# Altium project MasterBoard.PrjPCB
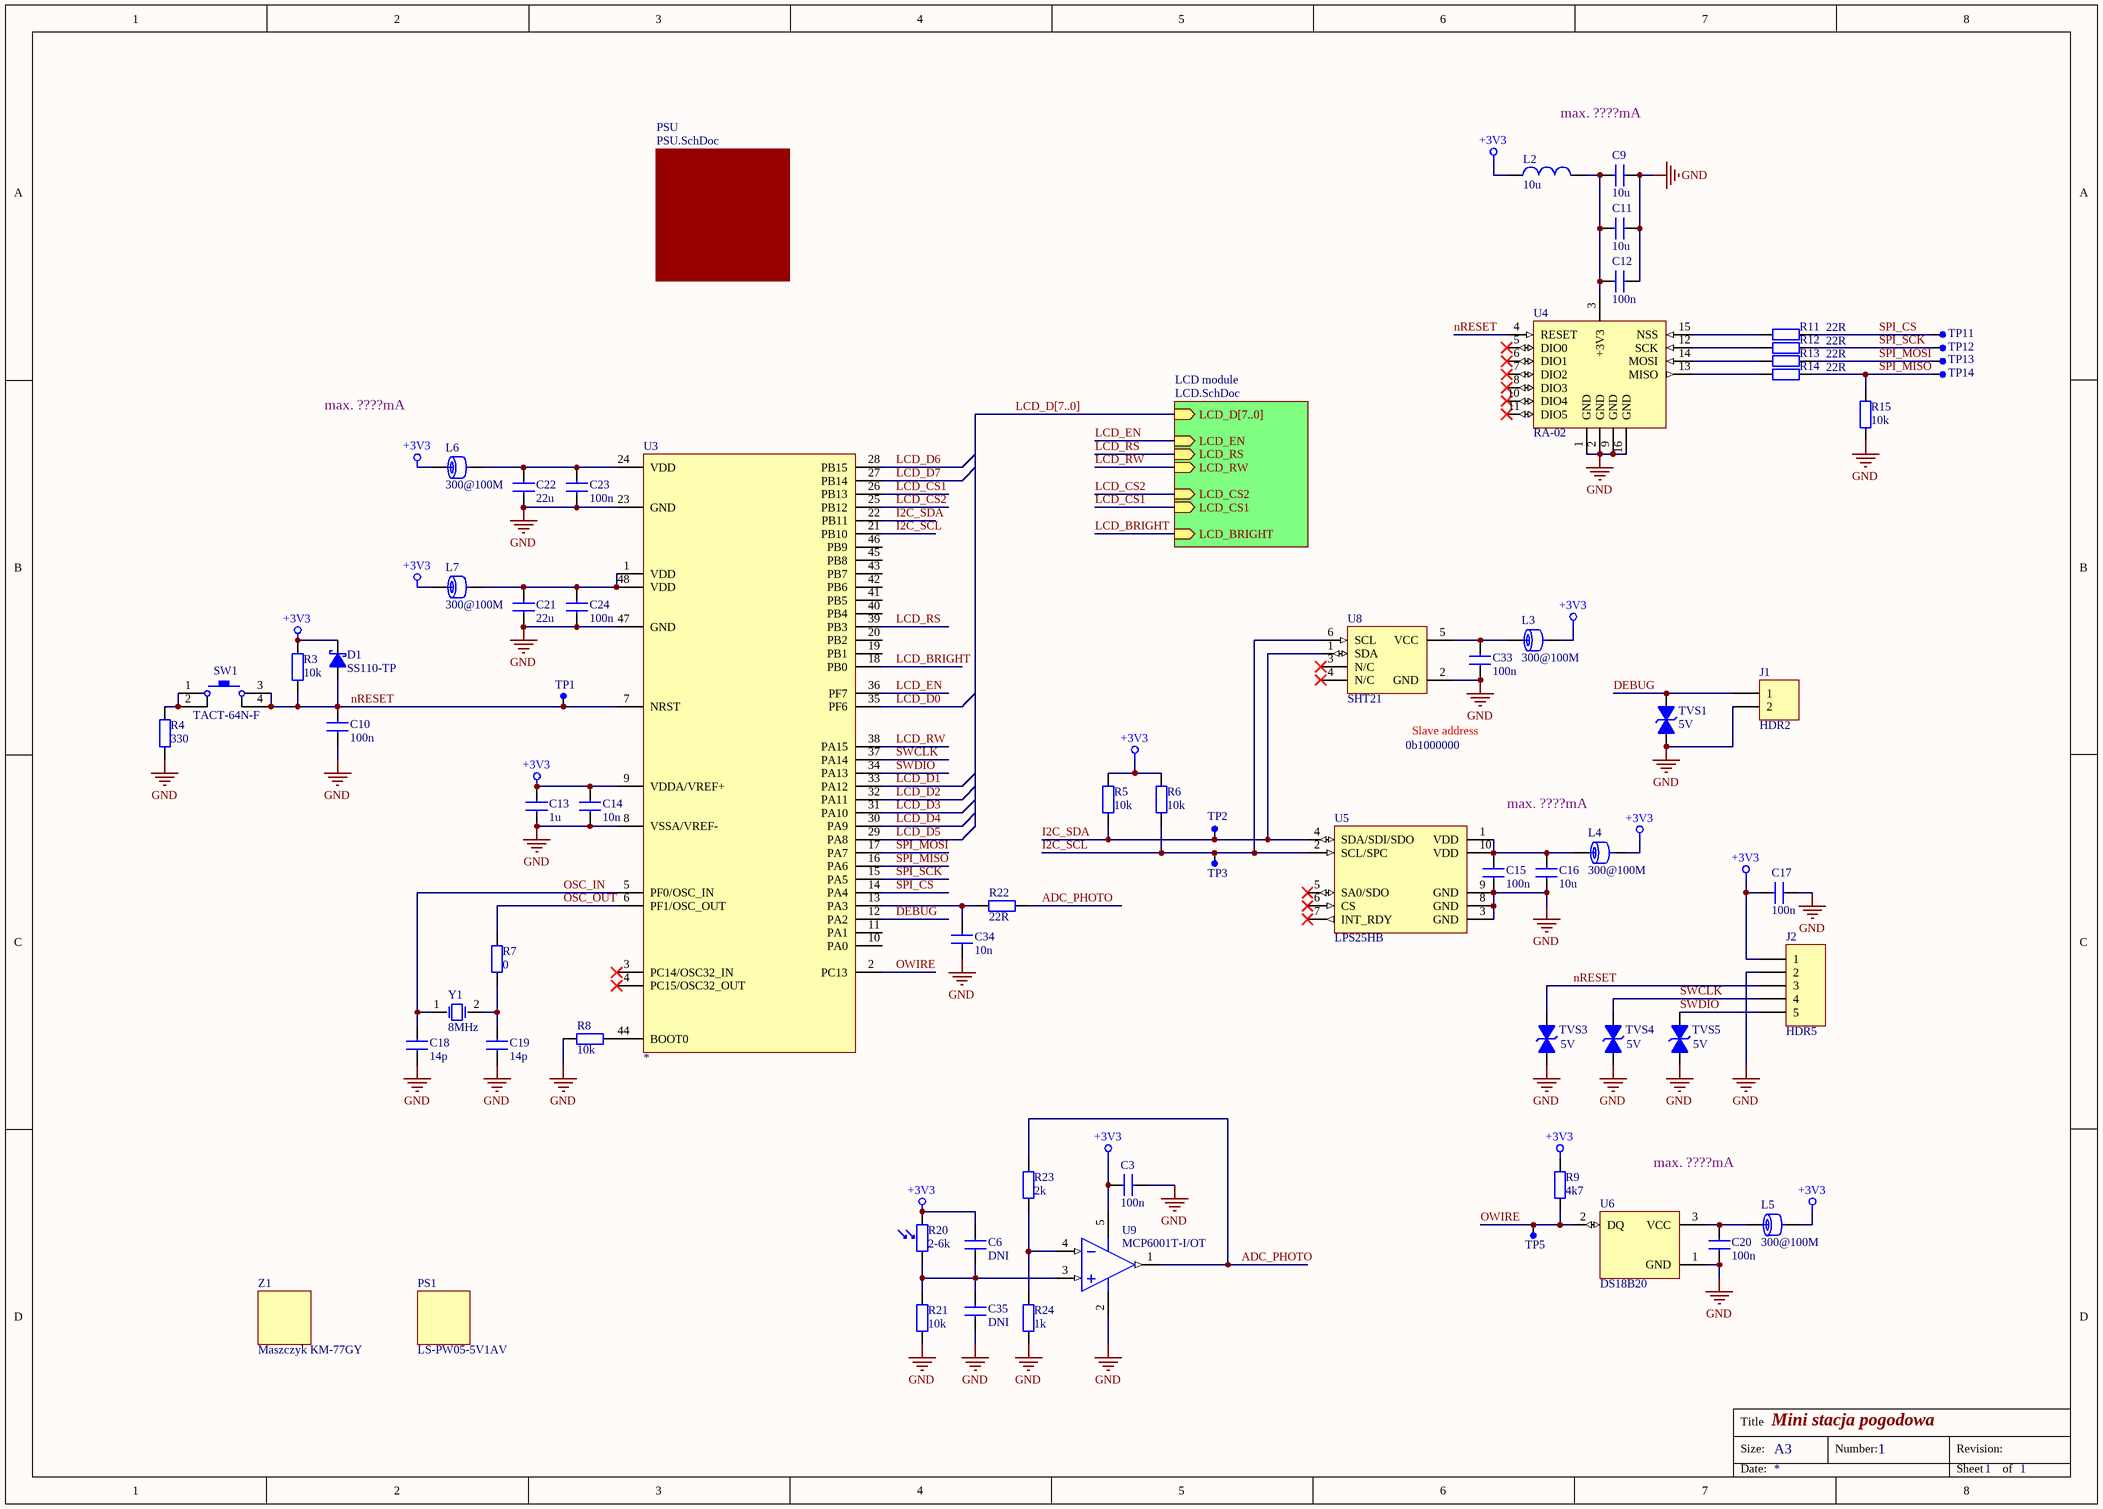
[diagram p0: Main.SchDoc]
.revision: 1.0
1 sheet, 69 parts. Net scope: hierarchical (ports join the sheet entries above them; power ports are global).
Board file: PCB.PcbDoc

## Sheet Main.SchDoc: Mini stacja pogodowa
size A3; DrawnBy: Damian Dolewski; Engineer: Damian Dolewski; DocumentNumber: 1; Revision: 1.0; SheetNumber: 1; SheetTotal: 1

### Parts
C3  value 100n  [C_0805]  (hidden comment: Capacitor)
C6  value DNI  [C_0805]  (hidden comment: Capacitor)
C9  value 10u  [C_0805]  (hidden comment: Capacitor)
C10  value 100n  [C_0805]  (hidden comment: Capacitor)
C11  value 10u  [C_0805]  (hidden comment: Capacitor)
C12  value 100n  [C_0805]  (hidden comment: Capacitor)
C13  value 1u  [C_0805]  (hidden comment: Capacitor)
C14  value 10n  [C_0805]  (hidden comment: Capacitor)
C15  value 100n  [C_0805]  (hidden comment: Capacitor)
C16  value 10u  [C_0805]  (hidden comment: Capacitor)
C17  value 100n  [C_0805]  (hidden comment: Capacitor)
C18  value 14p  [C_0805]  (hidden comment: Capacitor)
C19  value 14p  [C_0805]  (hidden comment: Capacitor)
C20  value 100n  [C_0805]  (hidden comment: Capacitor)
C21  value 22u  [C_0805]  (hidden comment: Capacitor)
C22  value 22u  [C_0805]  (hidden comment: Capacitor)
C23  value 100n  [C_0805]  (hidden comment: Capacitor)
C24  value 100n  [C_0805]  (hidden comment: Capacitor)
C33  value 100n  [C_0805]  (hidden comment: Capacitor)
C34  value 10n  [C_0805]  (hidden comment: Capacitor)
C35  value DNI  [C_0805]  (hidden comment: Capacitor)
D1  SS110-TP  [D_1206]
J1  value HDR2  [header 2.54mm 2pin]  (hidden comment: Header 2)
J2  value HDR5  [header 2.54mm 5pin]  (hidden comment: Header 5)
L2  value 10u  [L_0805]  (hidden comment: Inductor)
L3  value 300@100M  [L_0805]  (hidden comment: 742792031)
L4  value 300@100M  [L_0805]  (hidden comment: 742792031)
L5  value 300@100M  [L_0805]  (hidden comment: 742792031)
L6  value 300@100M  [L_0805]  (hidden comment: 742792031)
L7  value 300@100M  [L_0805]  (hidden comment: 742792031)
PS1  LS-PW05-5V1AV  (mechanical)
R3  value 10k  [R_0805]  (hidden comment: Resistor)
R4  value 330  [R_0805]  (hidden comment: Resistor)
R5  value 10k  [R_1206]  (hidden comment: Resistor)
R6  value 10k  [R_1206]  (hidden comment: Resistor)
R7  value 0  [R_0805]  (hidden comment: Resistor)
R8  value 10k  [R_1206]  (hidden comment: Resistor)
R9  value 4k7  [R_1206]  (hidden comment: Resistor)
R11  value 22R  [R_0805]  (hidden comment: Resistor)
R12  value 22R  [R_0805]  (hidden comment: Resistor)
R13  value 22R  [R_0805]  (hidden comment: Resistor)
R14  value 22R  [R_0805]  (hidden comment: Resistor)
R15  value 10k  [R_1206]  (hidden comment: Resistor)
R20  value 2-6k  [Photoresistor]  (hidden comment: PGM5506-MP)
R21  value 10k  [R_1206]  (hidden comment: Resistor)
R22  value 22R  [R_0805]  (hidden comment: Resistor)
R23  value 2k  [R_1206]  (hidden comment: Resistor)
R24  value 1k  [R_1206]  (hidden comment: Resistor)
SW1  value TACT-64N-F  [SPST_NO_1301]  (hidden comment: Switch-PB 4 Pins)
TP1  TEST PAD  [PIN]  (value not drawn)
TP2  TEST PAD  [PIN]  (value not drawn)
TP3  TEST PAD  [PIN]  (value not drawn)
TP5  TEST PAD  [PIN]  (value not drawn)
TP11  TEST PAD  [PIN]  (value not drawn)
TP12  TEST PAD  [PIN]  (value not drawn)
TP13  TEST PAD  [PIN]  (value not drawn)
TP14  TEST PAD  [PIN]  (value not drawn)
TVS1  value 5V  [D_1206]  (hidden comment: SMAJ5.0ALFCT-ND)
TVS3  value 5V  [D_SMA]  (hidden comment: SMAJ5.0ALFCT-ND)
TVS4  value 5V  [D_SMA]  (hidden comment: SMAJ5.0ALFCT-ND)
TVS5  value 5V  [D_SMA]  (hidden comment: SMAJ5.0ALFCT-ND)
U3  STM32F030C6T6  [LQFP-48]  (value not drawn)
U4  value RA-02  [RA-02]  (hidden comment: LoRa RA-02 SX1278 433MHz)
U5  LPS25HB  [LPS25HB]
U6  DS18B20  [TO-92]
U8  SHT21  [DFN6]
U9  value MCP6001T-I/OT  [SOT23-5]  (hidden comment: MCP6001T)
Y1  value 8MHz  [CFPX_217]  (hidden comment: 7A-8.000MAAE-T)
Z1  Maszczyk KM-77GY  [KM-77GY]

### Sub-sheets
LCD module = LCD.SchDoc (file not in this document): LCD_D[7..0] (in), LCD_CS1 (in), LCD_EN (in), LCD_RS (in), LCD_RW (in), LCD_CS2 (in), LCD_BRIGHT (in)
PSU = PSU.SchDoc (file not in this document): no entries

### Nets
+3V3: C3.2 C6.1 C13.2 C14.2 C17.2 D1.2(K) J2.1 L2.1 L3.2 L4.2 L5.2 L6.1 L7.1 R3.2 R5.2 R6.2 R9.2 R20.1 U3.9(VDDA/VREF+) U9.5(VCC+)
GND: C3.1 C9.1 C10.1 C11.1 C12.1 C13.1 C14.1 C15.1 C16.1 C17.1 C18.1 C19.1 C20.1 C21.2 C22.2 C23.2 C24.2 C33.1 C34.1 C35.2 J1.2 J2.2 R4.1 R8.2 R15.1 R21.1 R24.1 TVS1.1(A) TVS3.1(A) TVS4.1(A) TVS5.1(A) U3.8(VSSA/VREF-) U3.23(GND) U3.47(GND) U4.1(GND) U4.2(GND) U4.9(GND) U4.16(GND) U5.3(GND) U5.8(GND) U5.9(GND) U6.1(GND) U8.2(GND) U9.2(VCC-)
ADC_PHOTO: R22.1 R23.2 U9.1(OUT)
DEBUG: J1.1 TVS1.2(K) U3.12(PA2)
I2C_SCL: R6.1 TP3.1 U3.21(PB10) U5.2(SCL/SPC) U8.6(SCL)
I2C_SDA: R5.1 TP2.1 U3.22(PB11) U5.4(SDA/SDI/SDO) U8.1(SDA)
LCD_BRIGHT: U3.18(PB0) ; sheet LCD module/LCD_BRIGHT
LCD_CS1: U3.26(PB13) ; sheet LCD module/LCD_CS1
LCD_CS2: U3.25(PB12) ; sheet LCD module/LCD_CS2
LCD_D0: U3.35(PF6)
LCD_D1: U3.33(PA12)
LCD_D2: U3.32(PA11)
LCD_D3: U3.31(PA10)
LCD_D4: U3.30(PA9)
LCD_D5: U3.29(PA8)
LCD_D6: U3.28(PB15)
LCD_D7: U3.27(PB14)
LCD_EN: U3.36(PF7) ; sheet LCD module/LCD_EN
LCD_RS: U3.39(PB3) ; sheet LCD module/LCD_RS
LCD_RW: U3.38(PA15) ; sheet LCD module/LCD_RW
nRESET: C10.2 D1.1(A) J2.3 R3.1 SW1.3 SW1.4 TP1.1 TVS3.2(K) U3.7(NRST) U4.4(RESET)
OSC_IN: C18.2 U3.5(PF0/OSC_IN) Y1.1(OSC1)
OSC_OUT: R7.2 U3.6(PF1/OSC_OUT)
OWIRE: R9.1 TP5.1 U3.2(PC13) U6.2(DQ)
SPI_CS: R11.1 TP11.1 U3.14(PA4)
SPI_MISO: R14.1 R15.2 TP14.1 U3.16(PA6)
SPI_MOSI: R13.1 TP13.1 U3.17(PA7)
SPI_SCK: R12.1 TP12.1 U3.15(PA5)
SWCLK: J2.4 TVS4.2(K) U3.37(PA14)
SWDIO: J2.5 TVS5.2(K) U3.34(PA13)
NetC6_2: C6.2 C35.1 R20.2 R21.2 U9.3(IN+)
NetC9_2: C9.2 C11.2 C12.2 L2.2 U4.3(+3V3)
NetC15_2: C15.2 C16.2 L4.1 U5.1(VDD) U5.10(VDD)
NetC19_2: C19.2 R7.1 Y1.2(OSC2)
NetC20_2: C20.2 L5.1 U6.3(VCC)
NetC21_1: C21.1 C24.1 L7.2 U3.1(VDD) U3.48(VDD)
NetC22_1: C22.1 C23.1 L6.2 U3.24(VDD)
NetC33_2: C33.2 L3.1 U8.5(VCC)
NetC34_2: C34.2 R22.2 U3.13(PA3)
NetR4_2: R4.2 SW1.1 SW1.2
NetR8_1: R8.1 U3.44(BOOT0)
NetR11_2: R11.2 U4.15(NSS)
NetR12_2: R12.2 U4.12(SCK)
NetR13_2: R13.2 U4.14(MOSI)
NetR14_2: R14.2 U4.13(MISO)
NetR23_1: R23.1 R24.2 U9.4(IN-)

Not connected (* = marked no-connect by the designer): U3 3(PC14/OSC32_IN)* 4(PC15/OSC32_OUT)* 10(PA0) 11(PA1) 19(PB1) 20(PB2) 40(PB4) 41(PB5) 42(PB6) 43(PB7) 45(PB8) 46(PB9); U4 5(DIO0)* 6(DIO1)* 7(DIO2)* 8(DIO3)* 10(DIO4)* 11(DIO5)*; U5 5(SA0/SDO)* 6(CS)* 7(INT_RDY)*; U8 3(N/C)* 4(N/C)*

### Buses and harness runs
bus LCD_D[7..0] = sheet LCD module/LCD_D[7..0]

### Notes on the sheet
- max. ????mA
- 0b1000000
- (near U8) Slave address
- Title
- Size:
- A3
- Number:
- Revision:
- Date:
- Sheet
- of

### Library data of the parts
D1 = Diode Schottky: Schottky Diode; Value: SS110-TP
J1 = Header 2: Header, 2-Pin
J2 = Header 5: Header, 5-Pin
L3-L7 = FB: Ferrite Bead
PS1 = LS-PW05-5V1AV: 5VDC; 1A; EU; 82,7%
R20 = Resistor Photo: Photo Resistor
SW1 = Switch-PB 4 Pins: Switch 4 Pins
TP1 TP11-TP14 = TEST_PAD: PAD 1.5mm
TP2 TP3 TP5 = TEST_PAD
TVS1 TVS3-TVS5 = Transil
U3 = STM32F030C6T6: Microcontroler ARM; Flash: 32kB; 48MHz; SRAM: 4kB; LQFP48; Value: *
U4 = RA-02 SX1278
U5 = LPS25HB: MEMS pressure sensor: 260-1260 hPa absolute digital output barometer, HCLGA10, STM, RoHS; Value: LPS25HB
U6 = DS18B20: DS18B20  Programmable Resolution  1-Wire Digital Thermometer
U8 = SHT21: Humidity and Temperature Sensor IC; Value: SHT21
U9 = MCP6001T: Rail to Rail Operational Amplifier
Y1 = XTAL: Crystal Oscillator
Z1 = KM-77GY: X:80mm; Y:120mm; Z:31mm; ABS; gray